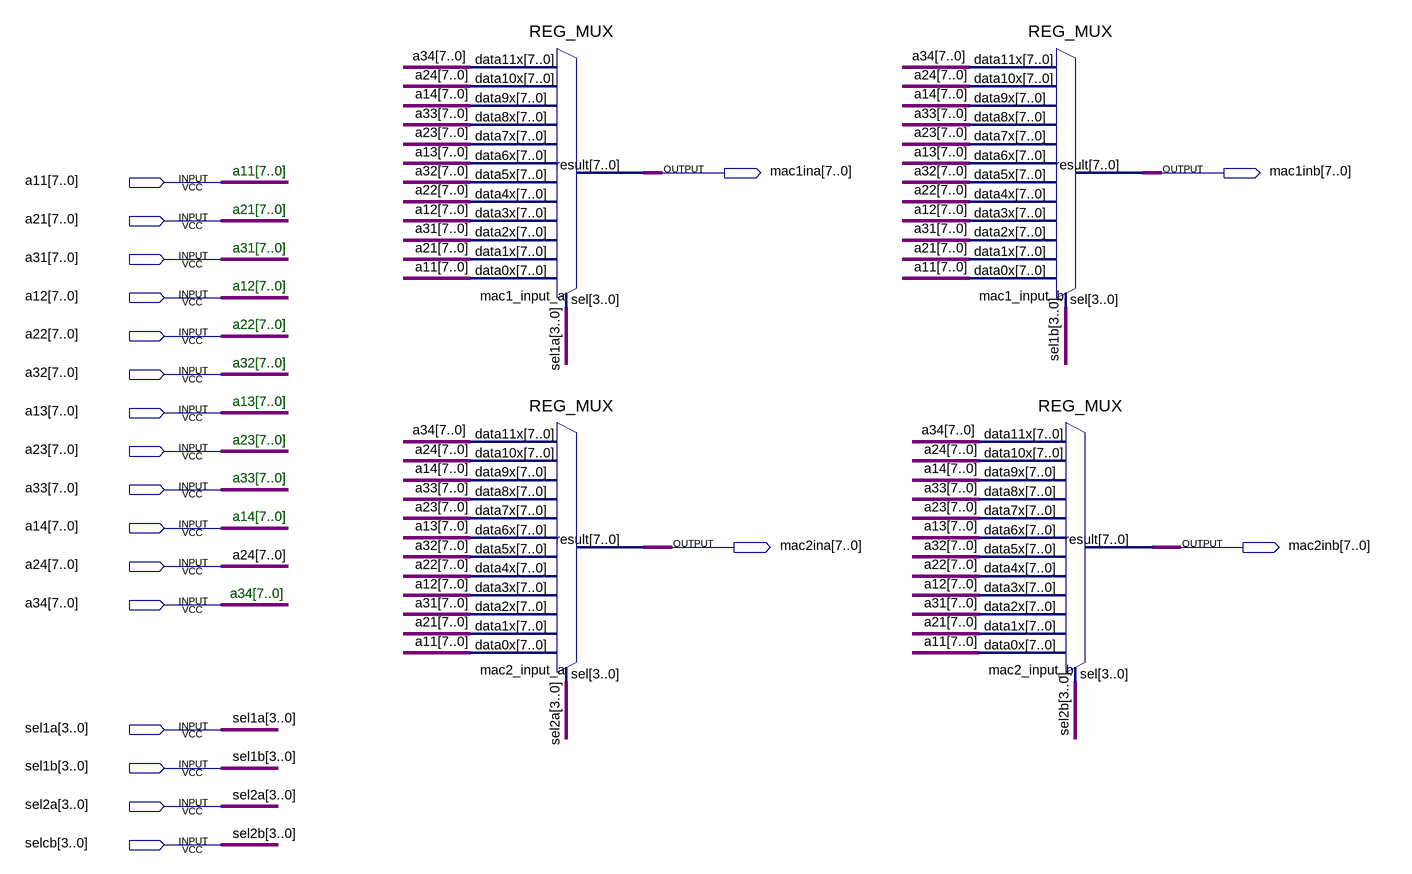
[diagram p0: schematic sheet]
// Quartus schematic mac_input_selector.bdf as structural Verilog: 4 symbols, 20 pins
module mac_input_selector (
  input  [7:0] a11,
  input  [7:0] a21,
  input  [7:0] a31,
  input  [7:0] a12,
  input  [7:0] a22,
  input  [7:0] a32,
  input  [7:0] a13,
  input  [7:0] a23,
  input  [7:0] a33,
  input  [7:0] a14,
  input  [7:0] a24,
  input  [7:0] a34,
  input  [3:0] sel1a,
  input  [3:0] sel1b,
  input  [3:0] sel2a,
  input  [3:0] selcb,
  output [7:0] mac1ina,
  output [7:0] mac1inb,
  output [7:0] mac2ina,
  output [7:0] mac2inb
);

  REG_MUX mac1_input_a (
    .data11x(a34), .data10x(a24), .data9x(a14), .data8x(a33), .data7x(a23), .data6x(a13), .data5x(a32),
    .data4x(a22), .data3x(a12), .data2x(a31), .data1x(a21), .data0x(a11), .sel(sel1a), .result(mac1ina));
  REG_MUX mac2_input_a (
    .data11x(a34), .data10x(a24), .data9x(a14), .data8x(a33), .data7x(a23), .data6x(a13), .data5x(a32),
    .data4x(a22), .data3x(a12), .data2x(a31), .data1x(a21), .data0x(a11), .sel(sel2a), .result(mac2ina));
  REG_MUX mac1_input_b (
    .data11x(a34), .data10x(a24), .data9x(a14), .data8x(a33), .data7x(a23), .data6x(a13), .data5x(a32),
    .data4x(a22), .data3x(a12), .data2x(a31), .data1x(a21), .data0x(a11), .sel(sel1b), .result(mac1inb));
  REG_MUX mac2_input_b (
    .data11x(a34), .data10x(a24), .data9x(a14), .data8x(a33), .data7x(a23), .data6x(a13), .data5x(a32),
    .data4x(a22), .data3x(a12), .data2x(a31), .data1x(a21), .data0x(a11), .sel(selcb), .result(mac2inb));

  // Other names for the same wires on the sheet: sel2b[3:0] = selcb

  // Notes on the sheet:
  //   a11[7..0]
  //   a21[7..0]
  //   a31[7..0]
  //   a12[7..0]
  //   a22[7..0]
  //   a32[7..0]
  //   a13[7..0]
  //   a23[7..0]
  //   a33[7..0]
  //   a14[7..0]
  //   a34[7..0]
endmodule
